# EAGLE design design (EAGLE 7.2.0)
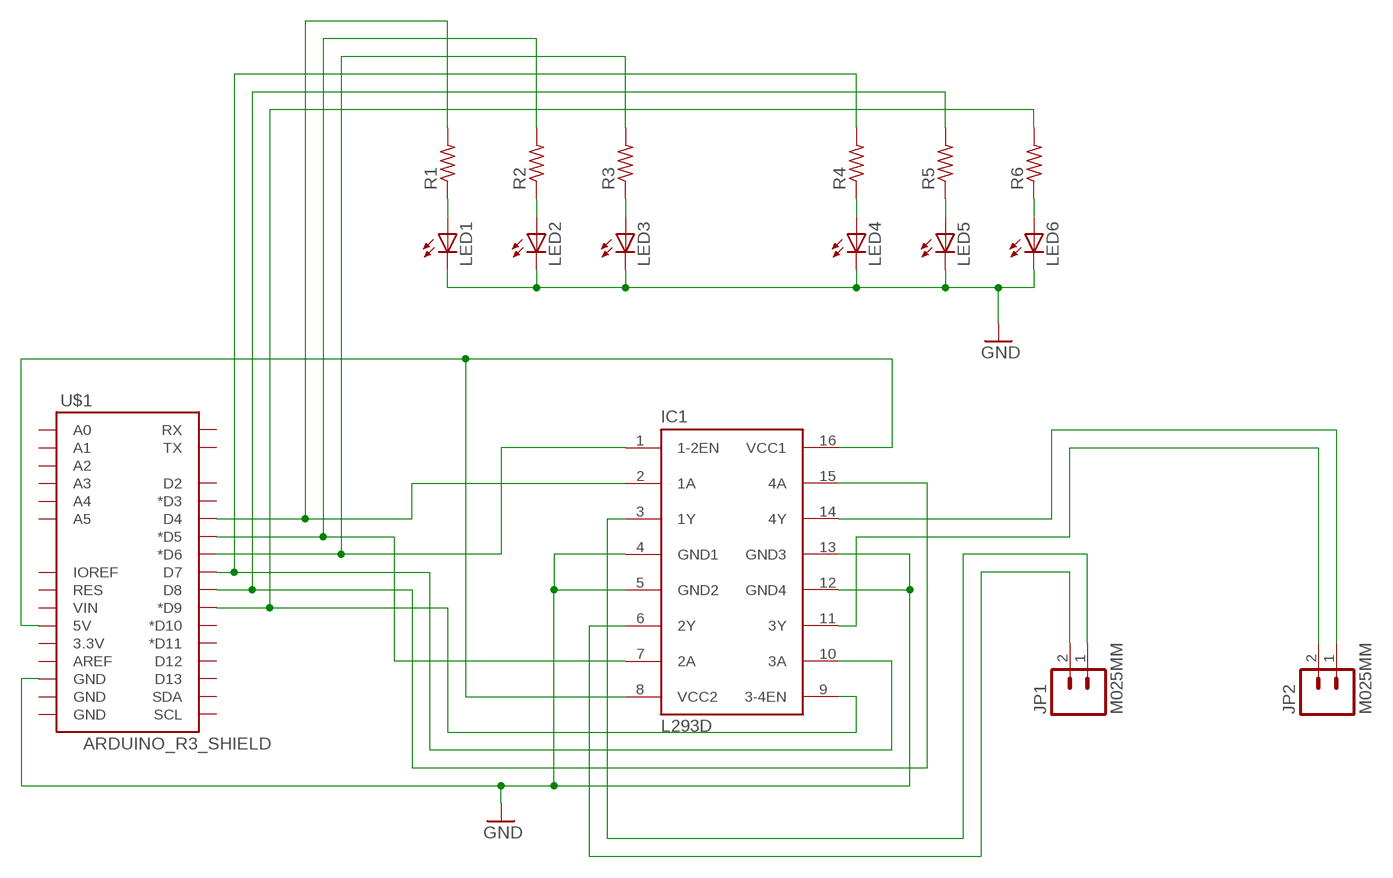
[diagram p0: schematic, sheet 1]

## Parts
IC1  L293D  [DIL16]
JP1  M025MM  [SCREWTERMINAL-5MM-2]
JP2  M025MM  [SCREWTERMINAL-5MM-2]
LED1  LED5MM  [LED5MM]
LED2  LED5MM  [LED5MM]
LED3  LED5MM  [LED5MM]
LED4  LED5MM  [LED5MM]
LED5  LED5MM  [LED5MM]
LED6  LED5MM  [LED5MM]
R1  R-US_0207/9  [0207/9]
R2  R-US_0207/9  [0207/9]
R3  R-US_0207/9  [0207/9]
R4  R-US_0207/9  [0207/9]
R5  R-US_0207/9  [0207/9]
R6  R-US_0207/9  [0207/9]
U$1  ARDUINO_R3_SHIELD  [UNO_R3_SHIELD]

## Nets
GND: IC1.4(GND1) IC1.5(GND2) IC1.12(GND4) IC1.13(GND3) LED1.K(C) LED2.K(C) LED3.K(C) LED4.K(C) LED5.K(C) LED6.K(C) U$1.GND@2(GND)
N$1: LED3.A R3.1
N$2: LED2.A R2.1
N$3: LED1.A R1.1
N$4: LED4.A R4.1
N$5: LED5.A R5.1
N$6: LED6.A R6.1
N$7: IC1.11(3Y) JP2.2
N$8: IC1.3(1Y) JP1.1
N$9: IC1.6(2Y) JP1.2
N$10: IC1.8(VCC2) IC1.16(VCC1) U$1.5V
N$11: IC1.14(4Y) JP2.1
N$12: IC1.1(1-2EN) R3.2 U$1.D6(*D6)
N$14: IC1.7(2A) R2.2 U$1.D5(*D5)
N$15: IC1.10(3A) R4.2 U$1.D7
N$17: IC1.9(3-4EN) R6.2 U$1.D9(*D9)
N$18: IC1.2(1A) R1.2 U$1.D4
N$22: IC1.15(4A) R5.2 U$1.D8
Unconnected: U$1.3.3V U$1.A0 U$1.A1 U$1.A2 U$1.A3 U$1.A4 U$1.A5 U$1.AREF U$1.D2 U$1.D3(*D3) U$1.D10(*D10) U$1.D11(*D11) U$1.D12 U$1.D13 U$1.GND@0(GND) U$1.GND@1(GND) U$1.IOREF U$1.RES U$1.RX U$1.SCL U$1.SDA U$1.TX U$1.VIN

## Library data of the parts
IC1 = st-microelectronics:L293D: PUSH-PULL 4 CHANNEL DRIVER; MPN: L293D; OC_FARNELL: 9589619; OC_NEWARK: 56P8249
JP1 JP2 = SparkFun-Connectors:M02: Standard 2-pin 0.1" header. Use with - straight break away headers ( PRT-00116) - right angle break away headers (PRT-00553) - swiss pins (PRT-00743) - machine pins (PRT-00117) - female headers (PRT-00115) Molex polarized connector foot print use with: PRT-08233 with associated crimp pins and housings. 2.54_SCREWTERM for use with PRT-10571. 3.5mm Screw Terminal footprints for PRT-08084 5mm Screw Terminal footprints for use with PRT-08433
LED1-LED6 = adafruit:LED: LED OSRAM: - CHIPLED LG R971, LG N971, LY N971, LG Q971, LY Q971, LO R971, LY R971 LH N974, LH R974 LS Q976, LO Q976, LY Q976 LO Q996 - Hyper CHIPLED LW Q18S LB Q993, LB Q99A, LB R99A - SideLED LS A670, LO A670, LY A670, LG A670, LP A670 LB A673, LV A673, LT A673, LW A673 LH A674 LY A675 LS A676, LA A676, LO A676, LY A676, LW A676 LS A679, LY A679, LG A679 - Hyper Micro SIDELED® LS Y876, LA Y876, LO Y876, LY Y876 LT Y87S - SmartLED LW L88C, LW L88S LB L89C, LB L89S, LG L890 LS L89K, LO L89K, LY L89K LS L896, LA L896, LO L896, LY L896 - TOPLED LS T670, LO T670, LY T670, LG T670, LP T670 LSG T670, LSP T670, LSY T670, LOP T670, LYG T670 LG T671, LOG T671, LSG T671 LB T673, LV T673, LT T673, LW T673 LH T674 LS T676, LA T676, LO T676, LY T676, LB T676, LH T676, LSB T676, LW T676 LB T67C, LV T67C, LT T67C, LS T67K, LO T67K, LY T67K, LW E67C LS E67B, LA E67B, LO E67B, LY E67B, LB E67C, LV E67C, LT E67C LW T67C LS T679, LY T679, LG T679 LS T770, LO T770, LY T770, LG T770, LP T770 LB T773, LV T773, LT T773, LW T773 LH T774 LS E675, LA E675, LY E675, LS T675 LS T776, LA T776, LO T776, LY T776, LB T776 LHGB T686 LT T68C, LB T68C - Hyper Mini TOPLED® LB M676 - Mini TOPLED Santana® LG M470 LS M47K, LO M47K, LY M47K Source: http://www.osram.convergy.de/
R1-R6 = adafruit:R-US_: RESISTOR, American symbol
U$1 = SparkFun-Boards:ARDUINO_R3_SHIELD: Shield form compatible with the Arduino Uno R3.

## Board
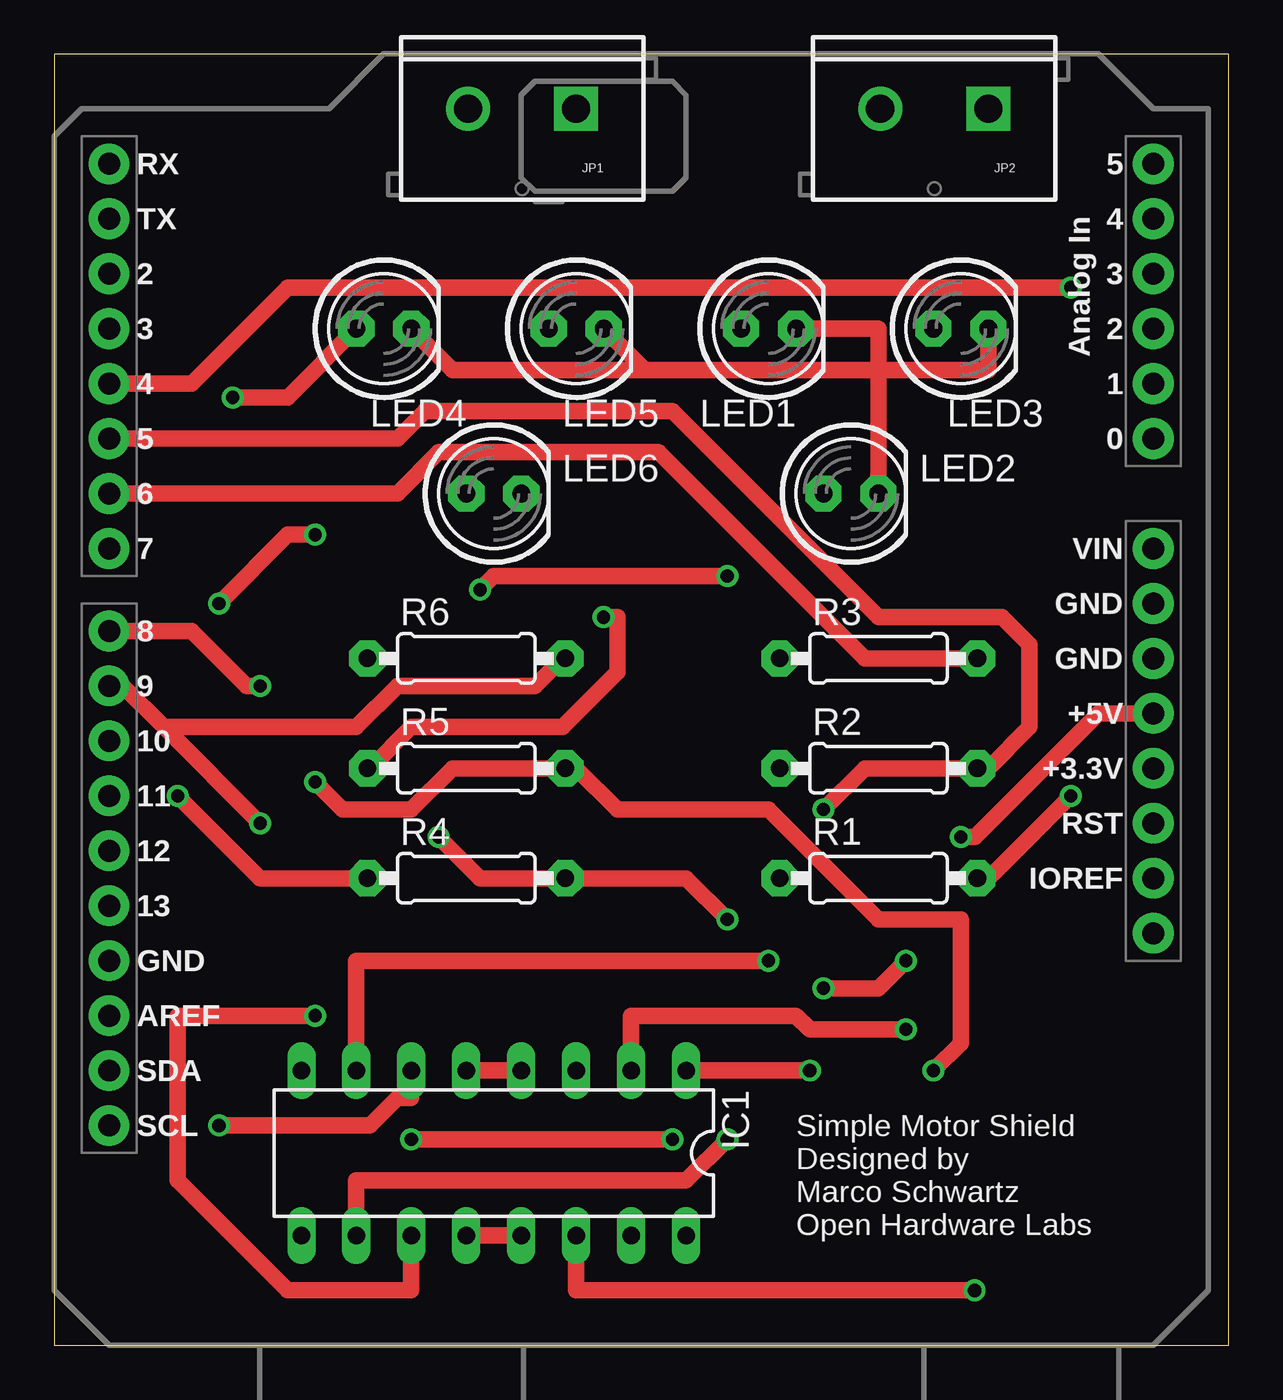
[diagram p1: board, top side]
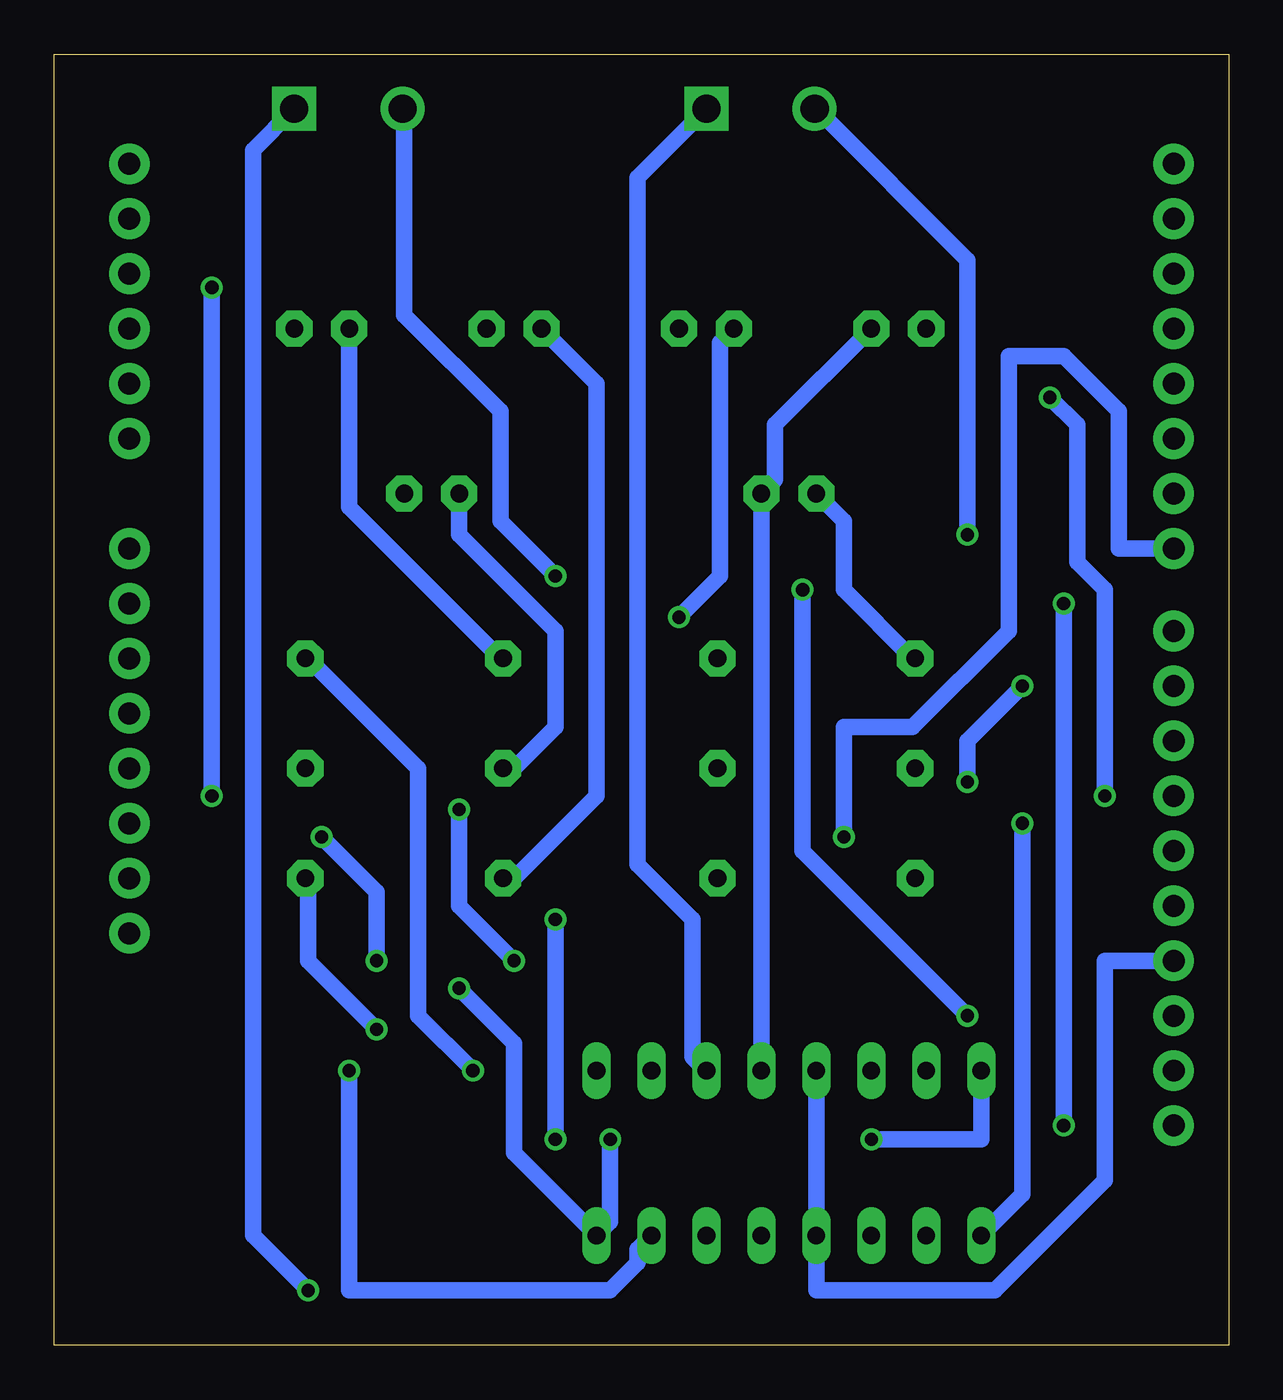
[diagram p2: board, bottom side, seen from below]

Size 54.28 x 59.68 mm. Coordinates in mm from the lower left corner, seen from the top.
Outline: 0,0 54.28,0 54.28,59.68 0,59.68 0,0
Copper layers (1*16): Top 0.035mm / dielectric 1.5mm / Bottom 0.035mm
Design rules "default *": minimum track width 30mil, minimum drill 24mil, track to track 25mil, track to pad 25mil, pad to pad 25mil, via to via 25mil, smd to smd 8mil, copper to edge 40mil, drill to drill 8mil, minimum pad ring 10mil, minimum via ring 8mil, stop-mask expansion 4mil, vias tented up to drill 0mil, thermal gap 10mil

### Footprints (pad centres in the part's own frame; a part is rotated, then mirrored left to right if it is on the bottom)
DIL16 = drill 0.813 long: 1 -8.89,-3.81; 2 -6.35,-3.81; 3 -3.81,-3.81; 4 -1.27,-3.81; 5 1.27,-3.81; 6 3.81,-3.81; 7 6.35,-3.81; 8 8.89,-3.81; 9 8.89,3.81; 10 6.35,3.81; 11 3.81,3.81; 12 1.27,3.81; 13 -1.27,3.81; 14 -3.81,3.81; 15 -6.35,3.81; 16 -8.89,3.81
SCREWTERMINAL-5MM-2 = drill 1.3 pad 2.032 square: 1 0,0 | drill 1.3 pad 2.032: 2 5,0
LED5MM = drill 0.813 pad 1.676 octagon: A -1.27,0; K 1.27,0
0207/9 = drill 0.813 pad 1.676 octagon: 1 -4.572,0; 2 4.572,0
UNO_R3_SHIELD = drill 1.016 pad 1.88: 3.3V 50.8,26.67; 5V 50.8,29.21; A0 50.8,41.91; A1 50.8,44.45; A2 50.8,46.99; A3 50.8,49.53; A4 50.8,52.07; A5 50.8,54.61; AREF 2.54,15.24; D2 2.54,49.53; D3 2.54,46.99; D4 2.54,44.45; D5 2.54,41.91; D6 2.54,39.37; D7 2.54,36.83; D8 2.54,33.02; D9 2.54,30.48; D10 2.54,27.94; D11 2.54,25.4; D12 2.54,22.86; D13 2.54,20.32; GND@0 50.8,31.75; GND@1 50.8,34.29; GND@2 2.54,17.78; IOREF 50.8,21.59; NC 50.8,19.05; RES 50.8,24.13; RX 2.54,54.61; SCL 2.54,10.16; SDA 2.54,12.7; TX 2.54,52.07; VIN 50.8,36.83

### Placement (x,y rotation side)
IC1  20.32,8.89 180 top
JP1  24.13,57.15 180 top
JP2  43.18,57.15 180 top
LED1  33.02,46.99 0 top
LED2  36.83,39.37 0 top
LED3  41.91,46.99 0 top
LED4  15.24,46.99 0 top
LED5  24.13,46.99 0 top
LED6  20.32,39.37 0 top
R1  38.1,21.59 0 top
R2  38.1,26.67 0 top
R3  38.1,31.75 0 top
R4  19.05,21.59 0 top
R5  19.05,26.67 0 top
R6  19.05,31.75 0 top
U$1  0,0 0 top

### Tracks (layer width: path | path; a pad name or v marks a point on that pad's centre or on a via)
GND
  Top 0.762: IC1.13 IC1.12 | IC1.4 IC1.5 | 38.1,45.09 38.1,46.99 LED1.K | 38.1,45.09 LED2.K | 27.3,45.09 LED5.K | 38.1,45.09 27.3,45.09 | LED3.K 43.18,45.09 38.1,45.09 | LED4.K 18.41,45.09 27.3,45.09
  Bottom 0.762: IC1.5 IC1.12 19.05,2.54 10.79,2.54 5.71,7.62 5.71,17.78 U$1.GND@2 | LED4.K 20.95,42.55 20.95,40.01 LED6.K IC1.4
N$1
  Bottom 0.762: LED3.A 40.64,38.73 33.66,31.75 R3.1
N$2
  Bottom 0.762: LED2.A 35.56,37.46 31.11,33.02 31.11,28.58 33.02,26.67 R2.1
N$3
  Bottom 0.762: LED1.A 29.21,44.45 29.21,25.4 33.02,21.59 R1.1
N$4  (via drill 0.61)
  Top 0.762: LED4.A 10.79,43.82 v8.26,43.82 | v5.71,25.4 9.53,21.59 R4.1
  Bottom 0.762: v8.26,43.82 6.99,42.55 6.99,36.2 5.71,34.92 v5.71,25.4
N$5  (via drill 0.61)
  Top 0.762: v25.4,33.66 26.04,33.66 26.04,31.12 23.5,28.58 16.51,28.58 14.61,26.67 R5.1
  Bottom 0.762: v25.4,33.66 23.5,35.56 23.5,46.35 LED5.A
N$6
  Bottom 0.762: LED6.A 17.78,38.1 17.78,34.92 14.61,31.75 R6.1
N$7  (via drill 0.61)
  Top 0.762: IC1.11 16.51,2.54 10.79,2.54 5.71,7.62 5.71,15.24 v12.06,15.24 | v19.68,34.92 20.32,35.56 v31.11,35.56
  Bottom 0.762: v12.06,15.24 19.68,22.86 v19.68,34.92 | v31.11,35.56 33.66,38.1 33.66,43.18 38.1,47.62 38.1,57.15 JP2.2
N$8
  Bottom 0.762: IC1.3 24.77,13.34 24.77,19.69 27.3,22.23 27.3,53.98 JP1.1
N$9  (via drill 0.61)
  Top 0.762: IC1.6 16.51,11.43 15.88,11.43 14.61,10.16 v7.62,10.16 | v7.62,34.29 10.79,37.46 v12.06,37.46
  Bottom 0.762: v7.62,34.29 v7.62,10.16 | v12.06,37.46 12.06,50.16 19.05,57.15 JP1.2
N$10  (via drill 0.61)
  Top 0.762: v16.51,9.52 v28.57,9.52 | U$1.5V 48.26,29.21 42.55,23.49 v41.91,23.49 | v39.37,17.78 38.1,16.51 v35.56,16.51
  Bottom 0.762: v28.57,9.52 28.57,5.71 IC1.16 33.02,8.89 33.02,13.97 v35.56,16.51 | v16.51,9.52 11.43,9.52 IC1.8 | v41.91,23.49 39.37,20.95 v39.37,17.78
N$11  (via drill 0.61)
  Top 0.762: IC1.14 24.13,2.54 v42.55,2.54
  Bottom 0.762: v42.55,2.54 45.09,5.08 45.09,55.24 JP2.1
N$12  (via drill 0.61)
  Top 0.762: v34.92,12.7 IC1.1 | U$1.D6 15.88,39.37 17.78,41.27 27.94,41.27 37.47,31.75 R3.2
  Bottom 0.762: v34.92,12.7 37.47,15.24 37.47,26.67 42.55,31.75 R3.2
N$14  (via drill 0.61)
  Top 0.762: IC1.7 13.97,17.78 v33.02,17.78 | v35.56,24.77 37.47,26.67 R2.2 43.18,26.67 45.09,28.58 45.09,32.38 43.81,33.66 38.1,33.66 28.57,43.18 17.14,43.18 15.88,41.91 U$1.D5
  Bottom 0.762: v33.02,17.78 35.56,20.32 v35.56,24.77
N$15  (via drill 0.61)
  Top 0.762: IC1.10 13.97,7.62 29.21,7.62 v31.11,9.52 | v31.11,19.69 29.21,21.59 R4.2 19.68,21.59 v17.78,23.49
  Bottom 0.762: v31.11,19.69 v31.11,9.52 | U$1.D7 5.08,36.83 5.08,43.18 7.62,45.72 10.16,45.72 10.16,33.02 14.61,28.58 17.78,28.58 v17.78,23.49
N$17  (via drill 0.61)
  Top 0.762: 5.08,28.58 3.17,30.48 U$1.D9 | 5.08,28.58 v9.53,24.13 | 5.08,28.58 13.97,28.58 15.88,30.48 22.23,30.48 23.5,31.75 R6.2
  Bottom 0.762: IC1.9 9.53,6.98 v9.53,24.13
N$18  (via drill 0.61)
  Top 0.762: IC1.2 26.67,15.24 34.29,15.24 34.92,14.6 v39.37,14.6 | U$1.D4 6.35,44.45 10.79,48.9 v46.99,48.9 | v46.99,25.4 43.18,21.59 R1.2
  Bottom 0.762: v39.37,14.6 42.55,17.78 42.55,21.59 R1.2 | v46.99,25.4 v46.99,48.9
N$22  (via drill 0.61)
  Top 0.762: v40.64,12.7 41.91,13.97 41.91,19.69 38.1,19.69 33.02,24.77 26.04,24.77 24.13,26.67 R5.2 18.41,26.67 16.51,24.77 13.34,24.77 v12.06,26.03 | U$1.D8 6.35,33.02 8.89,30.48 v9.53,30.48
  Bottom 0.762: IC1.15 27.3,4.45 27.3,3.81 28.57,2.54 40.64,2.54 v40.64,12.7 | v9.53,30.48 12.06,27.94 v12.06,26.03

### Text on the board
tNames: Simple Motor Shield / Designed by / Marco Schwartz / Open Hardware Labs